# EAGLE design W005 (EAGLE 6.6.0)
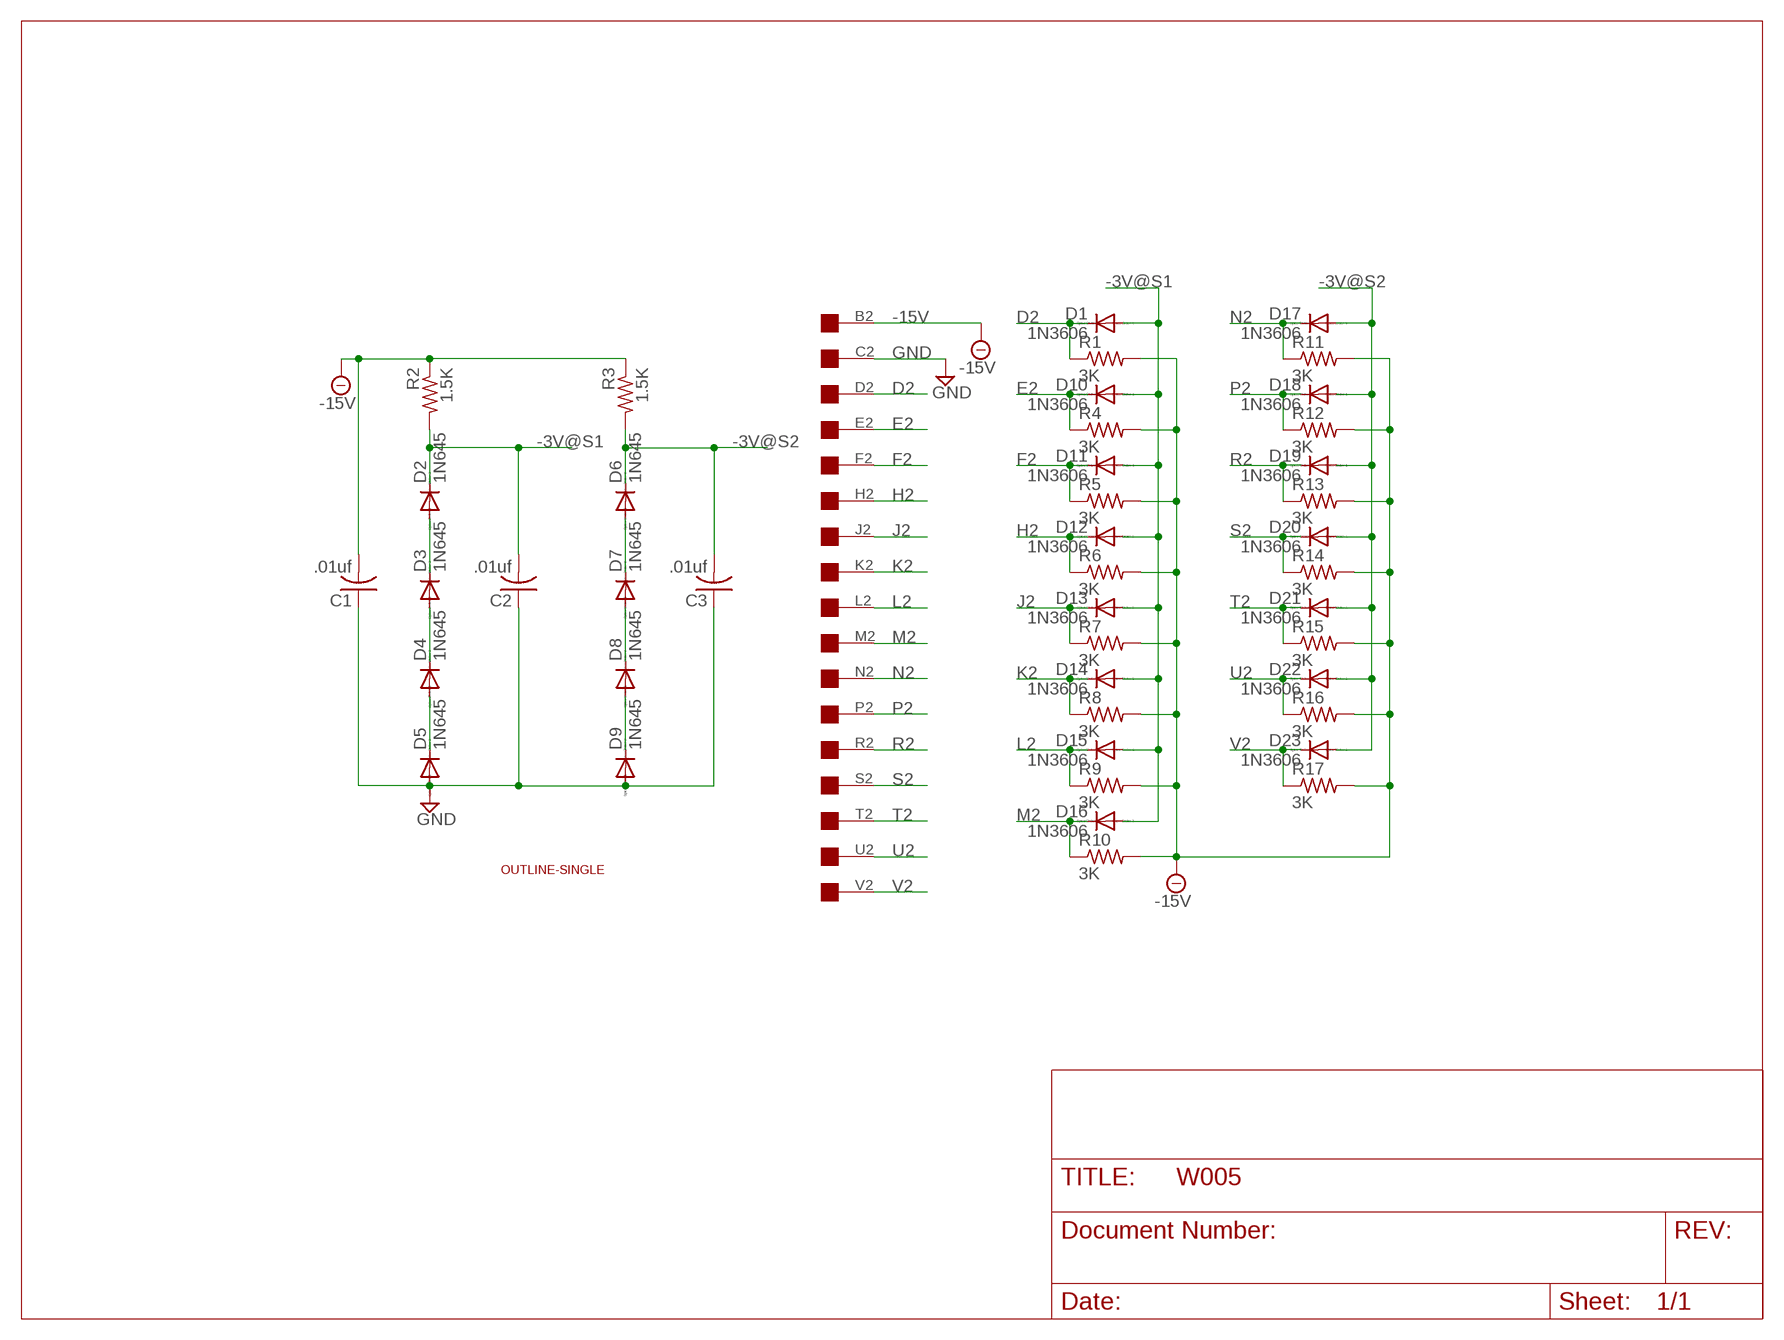
[diagram p0: schematic, sheet 1]

## Parts
C1  .01uf  C-US050-025X075  [C050-025X075]
C2  .01uf  C-US050-025X075  [C050-025X075]
C3  .01uf  C-US050-025X075  [C050-025X075]
D1  1N3606  1N4148DO35-10  [DO35-10]
D2  1N645  1N4148DO35-10  [DO35-10]
D3  1N645  1N4148DO35-10  [DO35-10]
D4  1N645  1N4148DO35-10  [DO35-10]
D5  1N645  1N4148DO35-10  [DO35-10]
D6  1N645  1N4148DO35-10  [DO35-10]
D7  1N645  1N4148DO35-10  [DO35-10]
D8  1N645  1N4148DO35-10  [DO35-10]
D9  1N645  1N4148DO35-10  [DO35-10]
D10  1N3606  1N4148DO35-10  [DO35-10]
D11  1N3606  1N4148DO35-10  [DO35-10]
D12  1N3606  1N4148DO35-10  [DO35-10]
D13  1N3606  1N4148DO35-10  [DO35-10]
D14  1N3606  1N4148DO35-10  [DO35-10]
D15  1N3606  1N4148DO35-10  [DO35-10]
D16  1N3606  1N4148DO35-10  [DO35-10]
D17  1N3606  1N4148DO35-10  [DO35-10]
D18  1N3606  1N4148DO35-10  [DO35-10]
D19  1N3606  1N4148DO35-10  [DO35-10]
D20  1N3606  1N4148DO35-10  [DO35-10]
D21  1N3606  1N4148DO35-10  [DO35-10]
D22  1N3606  1N4148DO35-10  [DO35-10]
D23  1N3606  1N4148DO35-10  [DO35-10]
R1  3K  R-US_0207/10  [0207/10]
R2  1.5K  R-US_0207/10  [0207/10]
R3  1.5K  R-US_0207/10  [0207/10]
R4  3K  R-US_0207/10  [0207/10]
R5  3K  R-US_0207/10  [0207/10]
R6  3K  R-US_0207/10  [0207/10]
R7  3K  R-US_0207/10  [0207/10]
R8  3K  R-US_0207/10  [0207/10]
R9  3K  R-US_0207/10  [0207/10]
R10  3K  R-US_0207/10  [0207/10]
R11  3K  R-US_0207/10  [0207/10]
R12  3K  R-US_0207/10  [0207/10]
R13  3K  R-US_0207/10  [0207/10]
R14  3K  R-US_0207/10  [0207/10]
R15  3K  R-US_0207/10  [0207/10]
R16  3K  R-US_0207/10  [0207/10]
R17  3K  R-US_0207/10  [0207/10]
U$1  EDGE-1  [EDGE-CON1]
U$2  OUTLINE-SINGLE  [SINGLE]

## Nets
-3V@S1: C2.2 D1.A D2.C D10.A D11.A D12.A D13.A D14.A D15.A D16.A R2.2
-3V@S2: C3.2 D6.C D17.A D18.A D19.A D20.A D21.A D22.A D23.A R3.2
-15V: C1.2 R1.2 R2.1 R3.1 R4.2 R5.2 R6.2 R7.2 R8.2 R9.2 R10.2 R11.2 R12.2 R13.2 R14.2 R15.2 R16.2 R17.2 U$1.B2
D2: D1.C R1.1 U$1.D2
E2: D10.C R4.1 U$1.E2
F2: D11.C R5.1 U$1.F2
GND: C1.1 C2.1 C3.1 D5.A D9.A U$1.C2
H2: D12.C R6.1 U$1.H2
J2: D13.C R7.1 U$1.J2
K2: D14.C R8.1 U$1.K2
L2: D15.C R9.1 U$1.L2
M2: D16.C R10.1 U$1.M2
N2: D17.C R11.1 U$1.N2
N$2: D2.A D3.C
N$3: D3.A D4.C
N$4: D4.A D5.C
N$7: D8.A D9.C
N$8: D7.A D8.C
N$9: D6.A D7.C
P2: D18.C R12.1 U$1.P2
R2: D19.C R13.1 U$1.R2
S2: D20.C R14.1 U$1.S2
T2: D21.C R15.1 U$1.T2
U2: D22.C R16.1 U$1.U2
V2: D23.C R17.1 U$1.V2
Unconnected: U$1.A2

## Library data of the parts
C1-C3 = rcl:C-US: CAPACITOR, American symbol
D1-D23 = diode:1N4148: DIODE high speed (Philips)
R1-R17 = rcl:R-US_: RESISTOR, American symbol
U$1 = dec-con:EDGE-1: Single-Sided DEC Edge Connector -- (side 2)
U$2 = dec-con:OUTLINE-*: Board outlines for DEC boards.

## Board
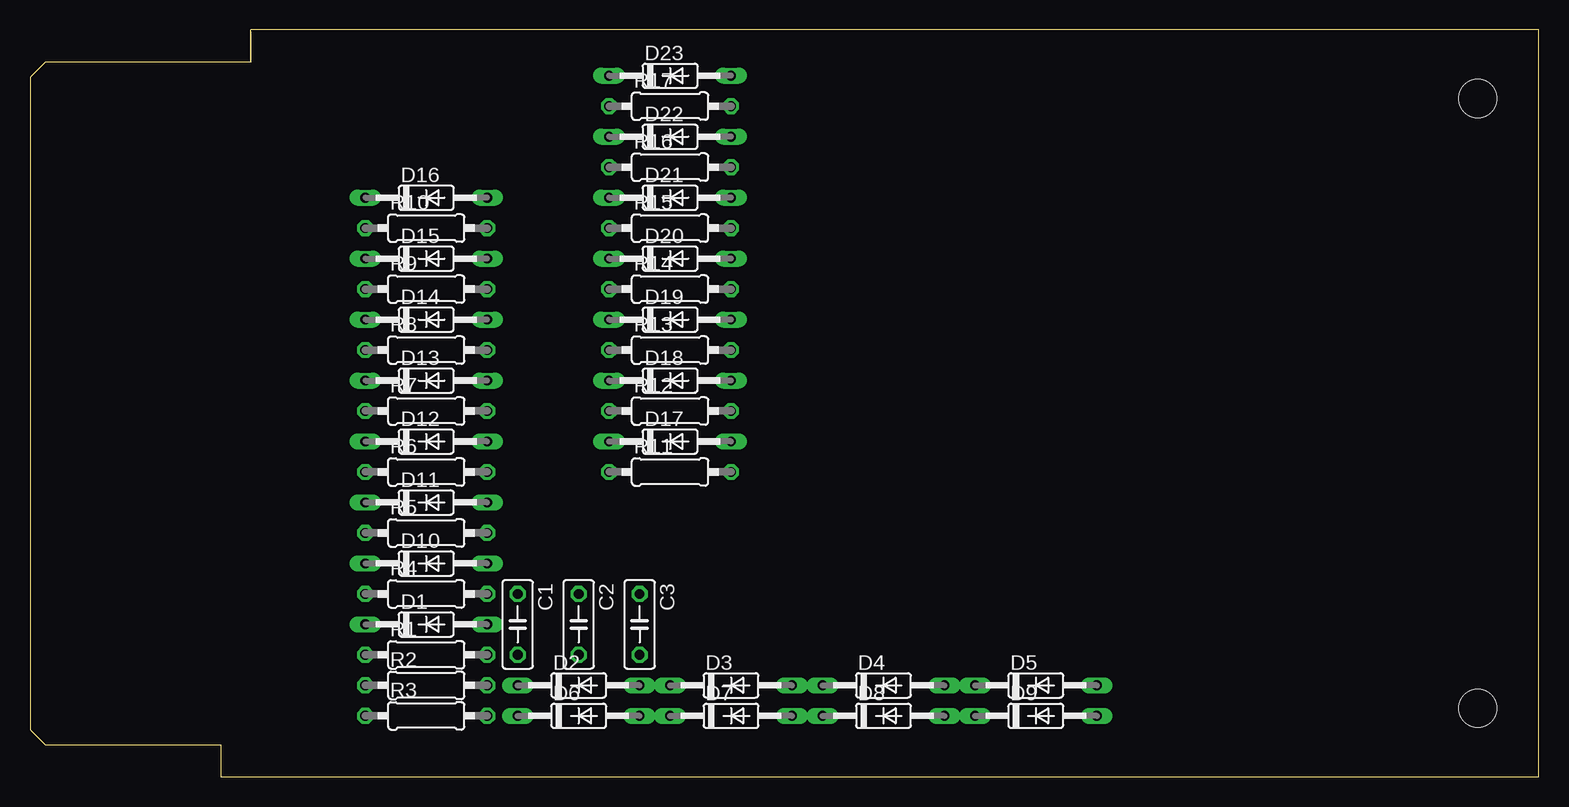
[diagram p1: board, top side]
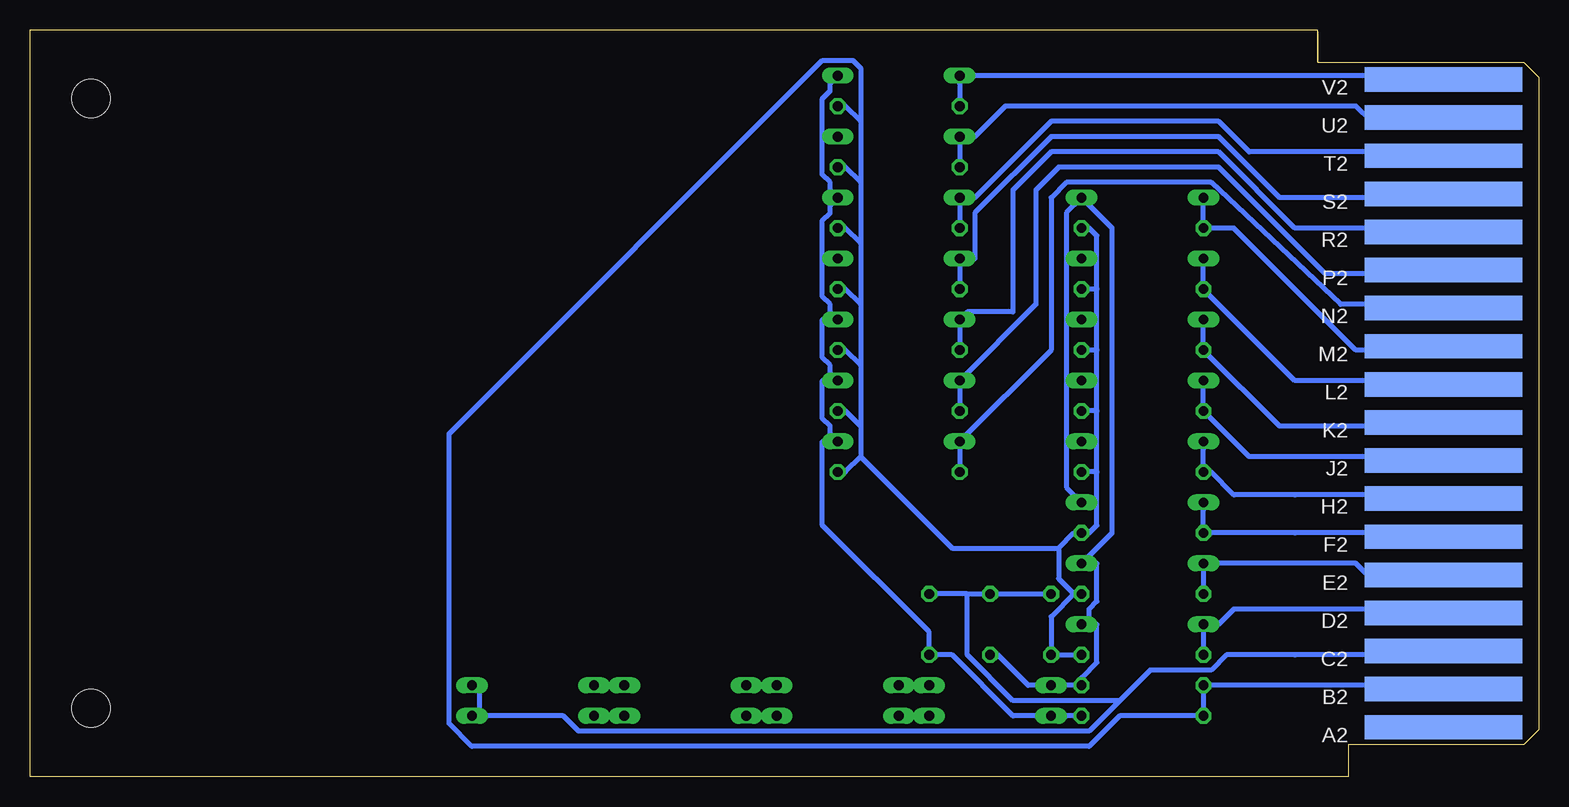
[diagram p2: board, bottom side, seen from below]

Size 125.73 x 62.23 mm. Coordinates in mm from the lower left corner, seen from the top.
Copper layers (1+16): Top 0.035mm / dielectric 1.5mm / Bottom 0.035mm
Design rules "16mils": minimum track width 16mil, minimum drill 32mil, track to track 15mil, track to pad 10mil, pad to pad 10mil, via to via 10mil, smd to smd 10mil, copper to edge 13mil, drill to drill 10mil, minimum pad ring 10mil, minimum via ring 8mil, stop-mask expansion 0mil, vias tented up to drill 0mil, thermal gap 10mil

### Footprints (pad centres in the part's own frame; a part is rotated, then mirrored left to right if it is on the bottom)
C050-025X075 = drill 0.813 octagon: 1 -2.54,0; 2 2.54,0
DO35-10 = drill 0.813 long: A 5.08,0; C -5.08,0
0207/10 = drill 0.813 octagon: 1 -5.08,0; 2 5.08,0
EDGE-CON1 = smd 13.106 x 2.032 bottom: A2 7.938,4.128; B2 7.938,7.303; C2 7.938,10.477; D2 7.938,13.652; E2 7.938,16.828; F2 7.938,20.003; H2 7.938,23.177; J2 7.938,26.352; K2 7.938,29.527; L2 7.938,32.703; M2 7.938,35.877; N2 7.938,39.053; P2 7.938,42.227; R2 7.938,45.403; S2 7.938,48.578; T2 7.938,51.752; U2 7.938,54.928; V2 7.938,58.102
SINGLE = hole 3.175: 120.65,56.515; 120.65,5.715

### Placement (x,y rotation side)
C1  40.64,12.7 270 top
C2  45.72,12.7 270 top
C3  50.8,12.7 270 top
D1  33.02,12.7 0 top
D2  45.72,7.62 0 top
D3  58.42,7.62 0 top
D4  71.12,7.62 0 top
D5  83.82,7.62 0 top
D6  45.72,5.08 0 top
D7  58.42,5.08 0 top
D8  71.12,5.08 0 top
D9  83.82,5.08 0 top
D10  33.02,17.78 0 top
D11  33.02,22.86 0 top
D12  33.02,27.94 0 top
D13  33.02,33.02 0 top
D14  33.02,38.1 0 top
D15  33.02,43.18 0 top
D16  33.02,48.26 0 top
D17  53.34,27.94 0 top
D18  53.34,33.02 0 top
D19  53.34,38.1 0 top
D20  53.34,43.18 0 top
D21  53.34,48.26 0 top
D22  53.34,53.34 0 top
D23  53.34,58.42 0 top
R1  33.02,10.16 0 top
R2  33.02,7.62 0 top
R3  33.02,5.08 0 top
R4  33.02,15.24 0 top
R5  33.02,20.32 0 top
R6  33.02,25.4 0 top
R7  33.02,30.48 0 top
R8  33.02,35.56 0 top
R9  33.02,40.64 0 top
R10  33.02,45.72 0 top
R11  53.34,25.4 0 top
R12  53.34,30.48 0 top
R13  53.34,35.56 0 top
R14  53.34,40.64 0 top
R15  53.34,45.72 0 top
R16  53.34,50.8 0 top
R17  53.34,55.88 0 top
U$1  0,0 0 top
U$2  0,0 0 top

### Tracks (layer width: path | path; a pad name or v marks a point on that pad's centre or on a via)
-3V@S1
  Bottom 0.406: C2.2 45.09,10.16 42.55,7.62 D2.C R2.2 38.1,8.26 36.83,9.53 36.83,12.7 D1.A 37.47,13.34 37.47,13.97 36.83,14.61 36.83,17.78 D10.A 35.56,20.32 35.56,45.72 D16.A 39.37,46.99 39.37,43.18 | 39.37,38.1 39.37,33.02 | 39.37,43.18 39.37,38.1 | 39.37,38.1 D14.A | 39.37,43.18 D15.A | 39.37,27.94 39.37,24.13 D11.A | 39.37,33.02 39.37,27.94 | 39.37,27.94 D12.A | 39.37,33.02 D13.A
-3V@S2
  Bottom 0.406: R3.2 38.74,5.08 39.37,5.08 D6.C 41.91,5.08 43.82,5.08 48.9,10.16 50.17,10.16 C3.2 50.8,10.79 50.8,12.06 59.69,20.95 59.69,27.94 D17.A 59.06,28.57 59.06,29.21 59.69,29.84 59.69,33.02 D18.A 59.06,33.66 59.06,34.29 59.69,34.92 59.69,38.1 D19.A 59.06,38.73 59.06,39.37 59.69,40.01 59.69,43.18 | 59.69,53.34 59.69,50.16 59.06,49.53 59.06,48.9 D21.A 59.06,47.62 59.06,46.99 59.69,46.35 59.69,43.18 | 59.69,53.34 D22.A 59.69,53.34 | 59.69,53.34 59.69,56.52 59.06,57.15 59.06,57.78 D23.A | 59.69,43.18 D20.A 59.69,43.18
-15V
  Bottom 0.406: R1.2 C1.2 40.64,13.34 38.74,15.24 | 36.83,25.4 36.83,20.95 37.47,20.32 R5.2 38.74,20.32 40.01,19.05 | 36.83,25.4 R6.2 | 36.83,25.4 36.83,30.48 | 36.83,30.48 R7.2 | 36.83,30.48 36.83,35.56 | 36.83,35.56 R8.2 | 36.83,35.56 36.83,40.64 | 36.83,40.64 R9.2 | 36.83,40.64 36.83,45.09 37.47,45.72 R10.2 | 38.74,15.24 40.01,16.51 40.01,19.05 | 38.74,15.24 R4.2 | 56.52,26.67 57.79,25.4 R11.2 | 56.52,29.21 56.52,26.67 | 56.52,29.21 57.79,30.48 R12.2 | 56.52,34.29 57.79,35.56 R13.2 | 56.52,34.29 56.52,29.21 | 56.52,39.37 57.79,40.64 R14.2 | 56.52,39.37 56.52,34.29 | 56.52,44.45 57.79,45.72 R15.2 | 56.52,44.45 56.52,39.37 | 56.52,49.53 57.79,50.8 R16.2 | 56.52,49.53 56.52,44.45 | 56.52,54.61 57.79,55.88 R17.2 | 56.52,54.61 56.52,49.53 | 56.52,54.61 56.52,59.05 57.15,59.69 59.69,59.69 90.81,28.57 90.81,4.45 88.9,2.54 37.47,2.54 34.93,5.08 R3.1 R2.1 13.97,7.62 U$1.B2 | 40.01,19.05 48.9,19.05 56.52,26.67
D2
  Bottom 0.406: R1.1 D1.C 26.67,12.7 25.4,13.97 13.97,13.97 U$1.D2
E2
  Bottom 0.406: R4.1 D10.C 15.24,17.78 13.97,16.51 U$1.E2
F2
  Bottom 0.406: D11.C 27.94,22.23 27.94,20.95 R5.1 27.31,20.32 20.32,20.32 13.97,20.32 U$1.F2
GND
  Bottom 0.406: D5.A 88.27,6.99 88.27,5.71 D9.A 87.63,5.08 81.28,5.08 80.01,3.81 37.47,3.81 34.93,6.35 | C1.1 41.28,15.24 45.09,15.24 C2.1 46.36,15.24 47.63,15.24 | 47.63,15.24 50.17,15.24 C3.1 | 34.93,6.35 32.39,8.89 27.31,8.89 26.04,10.16 20.32,10.16 13.97,10.16 U$1.C2 | 47.63,15.24 47.63,10.16 43.82,6.35 34.93,6.35
H2
  Bottom 0.406: D12.C 27.94,27.3 27.94,26.04 R6.1 27.31,25.4 25.4,23.5 20.32,23.5 13.97,23.5 U$1.H2
J2
  Bottom 0.406: D13.C R7.1 24.13,26.67 13.97,26.67 U$1.J2
K2
  Bottom 0.406: D14.C R8.1 21.59,29.21 13.97,29.21 U$1.K2
L2
  Bottom 0.406: D15.C R9.1 20.32,33.02 13.97,33.02 U$1.L2
M2
  Bottom 0.406: D16.C R10.1 25.4,45.72 15.24,35.56 13.97,35.56 U$1.M2
N2
  Bottom 0.406: R11.1 D17.C 40.64,35.56 40.64,48.26 39.37,49.53 27.31,49.53 16.51,39.37 12.7,39.37 U$1.N2
N$2
  Bottom 0.406: D2.A 52.07,7.62 D3.C
N$3
  Bottom 0.406: D3.A 64.77,7.62 D4.C
N$4
  Bottom 0.406: D4.A 77.47,7.62 D5.C
N$7
  Bottom 0.406: D8.A 77.47,5.08 D9.C
N$8
  Bottom 0.406: D7.A 64.77,5.08 D8.C
N$9
  Bottom 0.406: D6.A 52.07,5.08 D7.C
P2
  Bottom 0.406: R12.1 D18.C 41.91,39.37 41.91,48.9 40.01,50.8 26.67,50.8 17.78,41.91 12.7,41.91 U$1.P2
R2
  Bottom 0.406: R13.1 D19.C 47.63,38.73 43.82,38.73 43.82,48.9 40.64,52.07 26.67,52.07 20.32,45.72 13.34,45.72 U$1.R2
S2
  Bottom 0.406: R14.1 D20.C 46.99,43.18 46.99,46.99 40.64,53.34 26.67,53.34 21.59,48.26 13.34,48.26 U$1.S2
T2
  Bottom 0.406: R15.1 D21.C 46.99,48.26 40.64,54.61 26.67,54.61 24.13,52.07 13.97,52.07 U$1.T2
U2
  Bottom 0.406: R16.1 D22.C 46.99,53.34 44.45,55.88 15.24,55.88 13.97,54.61 U$1.U2
V2
  Bottom 0.406: R17.1 48.26,56.52 48.26,57.78 D23.C 46.99,58.42 20.32,58.42 13.97,58.42 U$1.V2